# EAGLE design mcu_energy (EAGLE 9.5.2)
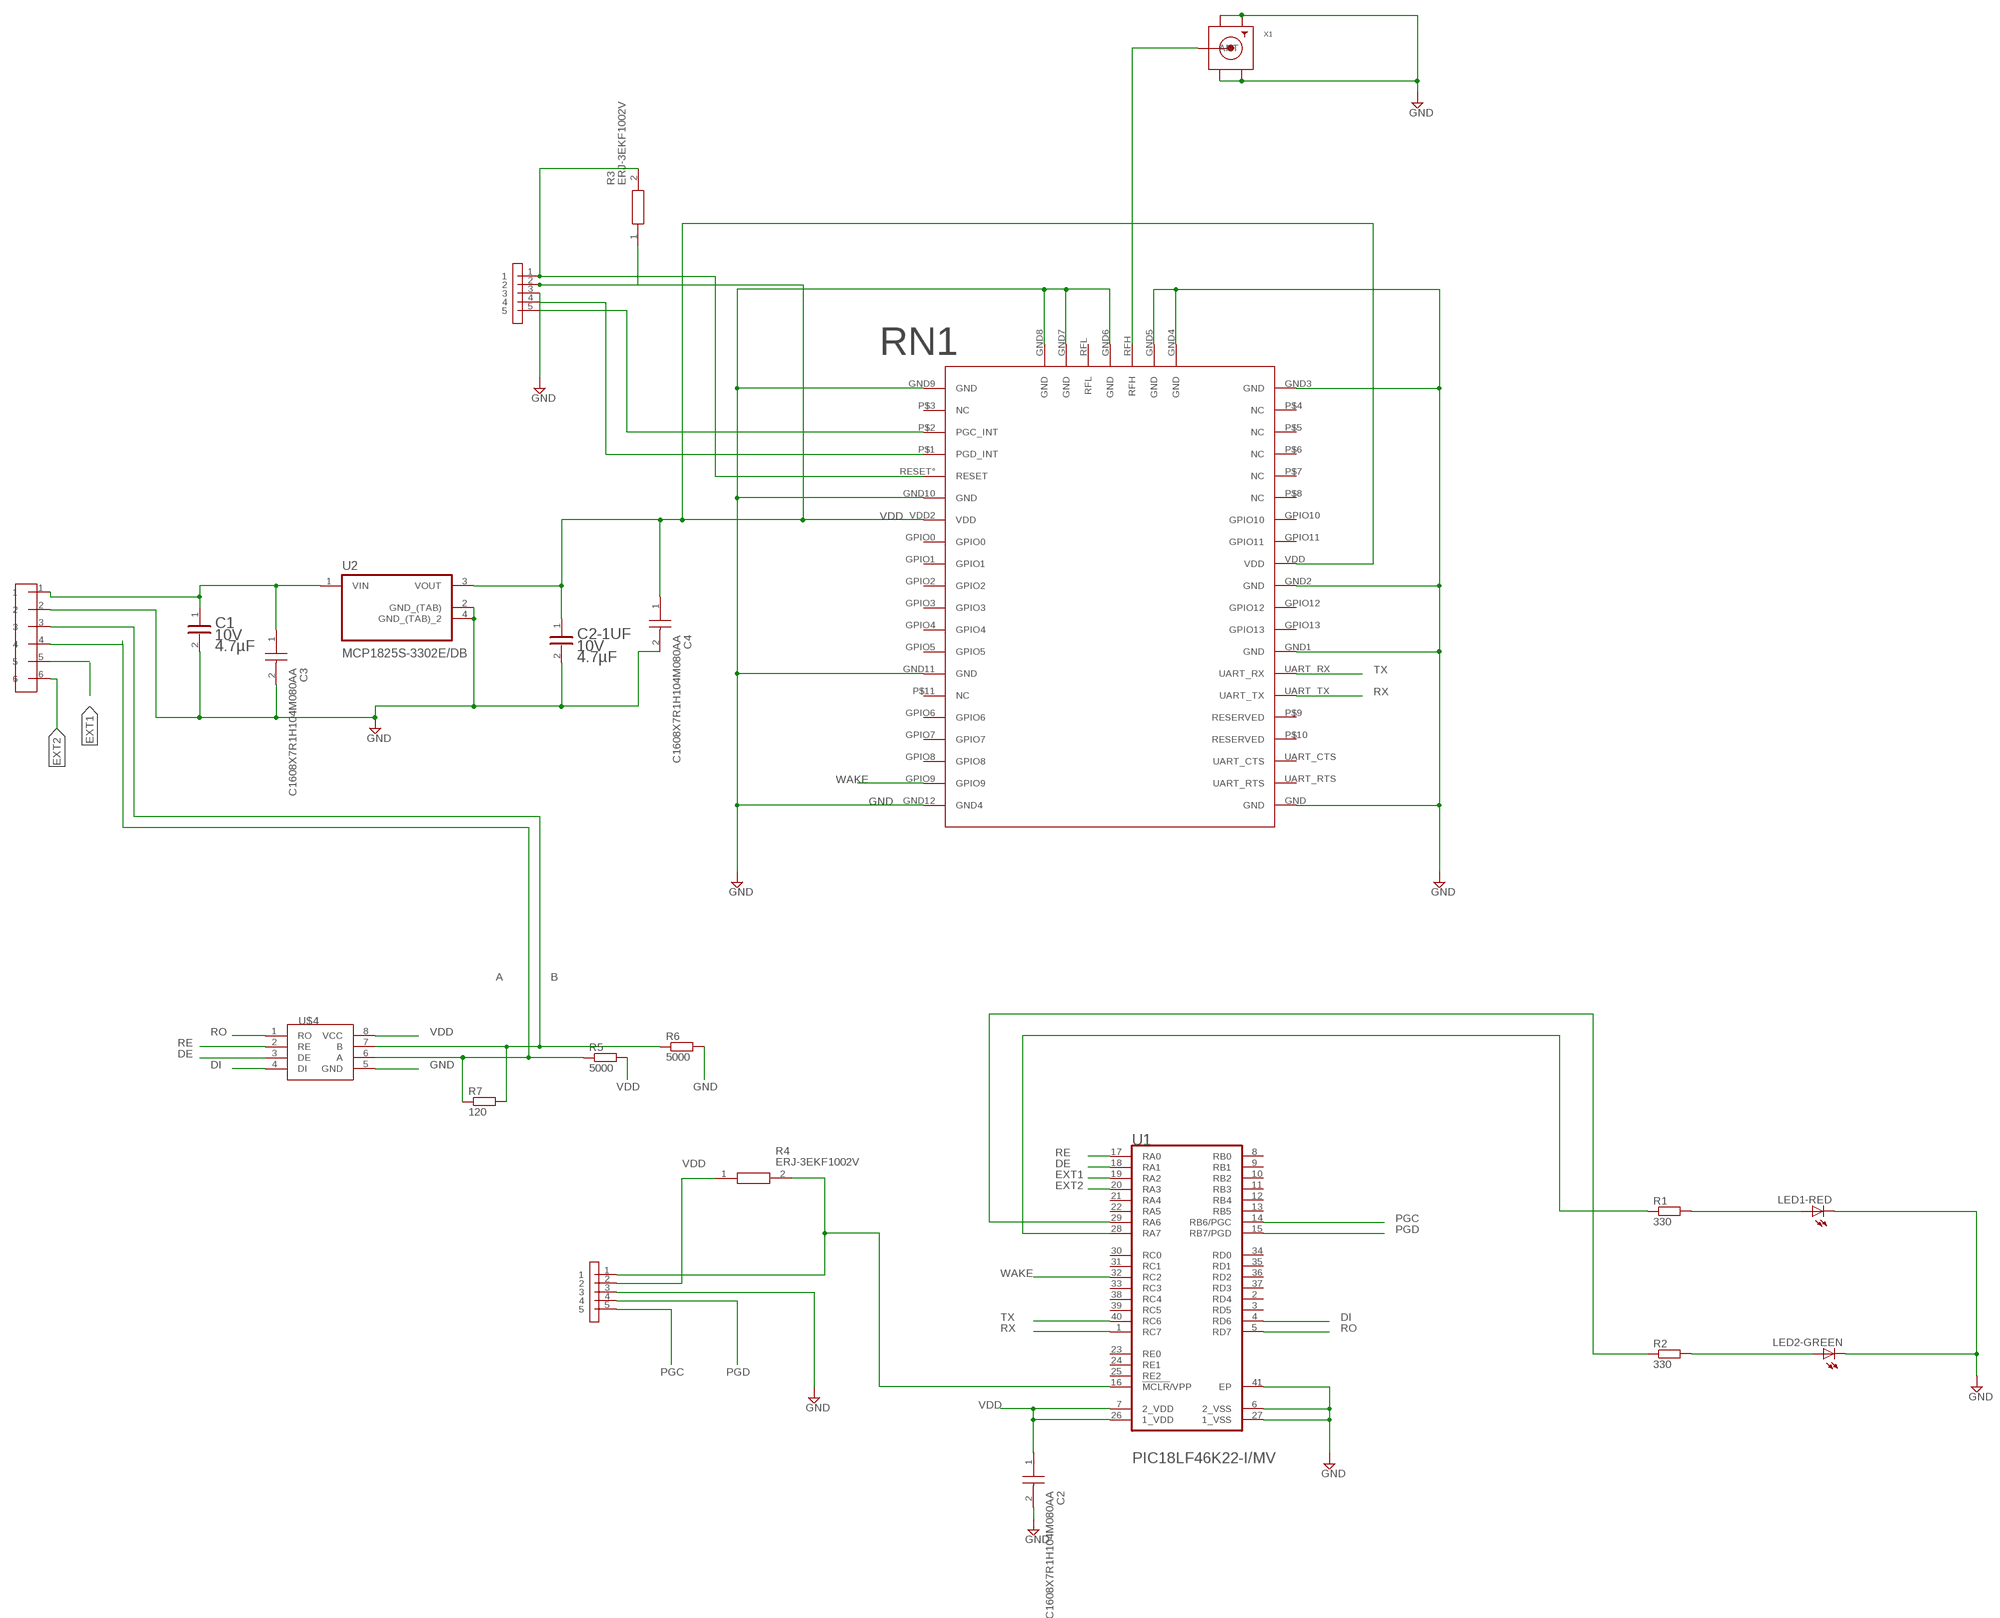
[diagram p0: schematic, sheet 1]

## Parts
C1  KEMET_C0603C475K8PACTUKEMET_C0603C475K8PACTU_0_0  [KEMET_C0603C475K8PACTU_0]
C2  C1608X7R1H104M080AA  [CAPC1608X80N]
C2-1UF  KEMET_C0603C475K8PACTUKEMET_C0603C475K8PACTU_0_0  [KEMET_C0603C475K8PACTU_0]
C3  C1608X7R1H104M080AA  [CAPC1608X80N]
C4  C1608X7R1H104M080AA  [CAPC1608X80N]
LED1-RED  LEDCHIP-LED0603  [CHIP-LED0603]
LED2-GREEN  LEDCHIP-LED0603  [CHIP-LED0603]
R1  330  R-EU_R0603  [R0603]
R2  330  R-EU_R0603  [R0603]
R3  ERJ-3EKF1002V  [RESC1608X55N]
R4  ERJ-3EKF1002V  [RESC1608X55N]
R5  5000  R-EU_R0805  [R0805]
R6  5000  R-EU_R0805  [R0805]
R7  120  R-EU_R0805  [R0805]
RN1  NEW_RN2483  [NEW_RN2483]
U1  MICROCHIP_PIC18LF46K22-I-MVMICROCHIP_PIC18LF46K22-I-MV_0_1  [MICROCHIP_PIC18LF46K22-I-MV_1]
U2  MCP1825S-3302E/DB  [SOT230P700X180-4N]
U$1  CONNECTOR62  [CONNECTOR6]
U$2  ICSP52  [ICSP]
U$3  ICSP52  [ICSP]
U$4  AMD3485E  [AMD3485E]
X1  SMACONNECTOR_EDGE  [SMA_EDGELAUNCH]

## Nets
A: R5.1 R7.1 U$1.4 U$4.6(A)
B: R6.1 R7.2 U$1.3 U$4.7(B)
DE: U1.18(RA1) U$4.3(DE)
DI: U1.4(RD6) U$4.4(DI)
EXT1: U1.19(RA2) U$1.5
EXT2: U1.20(RA3) U$1.6
GND: C1.2 C2-1UF.2 C2.2 C3.2 C4.2 LED1-RED.C LED2-GREEN.C R6.2 RN1.GND RN1.GND1(GND) RN1.GND2(GND) RN1.GND3(GND) RN1.GND4(GND) RN1.GND5(GND) RN1.GND6(GND) RN1.GND7(GND) RN1.GND8(GND) RN1.GND9(GND) RN1.GND10(GND) RN1.GND11(GND) RN1.GND12(GND4) U1.6(2_VSS) U1.27(1_VSS) U1.41(EP) U2.2(GND_(TAB)) U2.4(GND_(TAB)_2) U$1.2 U$2.3 U$3.3 U$4.5(GND) X1.GND@1(GND4) X1.GND@2(GND3) X1.GND@3(GND2) X1.GND@4(GND1)
N$1: LED1-RED.A R1.2
N$2: LED2-GREEN.A R2.2
N$3: R2.1 U1.29(RA6)
N$4: R1.1 U1.28(RA7)
N$5: C1.1 C3.1 U2.1(VIN) U$1.1
N$6: RN1.P$2(PGC_INT) U$3.5
N$7: R4.2 U1.16(!MCLR!/VPP) U$2.1
N$8: RN1.P$1(PGD_INT) U$3.4
N$9: R3.2 RN1.RESET°(RESET) U$3.1
N$10: RN1.RFH X1.P(ANT)
PGC: U1.14(RB6/PGC) U$2.5
PGD: U1.15(RB7/PGD) U$2.4
RE: U1.17(RA0) U$4.2(RE)
RO: U1.5(RD7) U$4.1(RO)
RX: RN1.UART_TX U1.1(RC7)
TX: RN1.UART_RX U1.40(RC6)
VDD: C2-1UF.1 C2.1 C4.1 R3.1 R4.1 R5.2 RN1.VDD RN1.VDD2(VDD) U1.7(2_VDD) U1.26(1_VDD) U2.3(VOUT) U$2.2 U$3.2 U$4.8(VCC)
WAKE: RN1.GPIO9 U1.32(RC2)
Unconnected: RN1.GPIO0 RN1.GPIO1 RN1.GPIO2 RN1.GPIO3 RN1.GPIO4 RN1.GPIO5 RN1.GPIO6 RN1.GPIO7 RN1.GPIO8 RN1.GPIO10 RN1.GPIO11 RN1.GPIO12 RN1.GPIO13 RN1.P$3(NC) RN1.P$4(NC) RN1.P$5(NC) RN1.P$6(NC) RN1.P$7(NC) RN1.P$8(NC) RN1.P$9(RESERVED) RN1.P$10(RESERVED) RN1.P$11(NC) RN1.RFL RN1.UART_CTS RN1.UART_RTS U1.2(RD4) U1.3(RD5) U1.8(RB0) U1.9(RB1) U1.10(RB2) U1.11(RB3) U1.12(RB4) U1.13(RB5) U1.21(RA4) U1.22(RA5) U1.23(RE0) U1.24(RE1) U1.25(RE2) U1.30(RC0) U1.31(RC1) U1.33(RC3) U1.34(RD0) U1.35(RD1) U1.36(RD2) U1.37(RD3) U1.38(RC4) U1.39(RC5)

## Library data of the parts
C1 C2-1UF = Kemet - C0603C475K8PACTU:KEMET_C0603C475K8PACTU: CAP CER 4.7UF 10V X5R 0603; CAPACITANCE: 4.7µF; CENTROID_NOT_SPECIFIED: No; DATASHEET: https://search.kemet.com/component-edge/download/datasheet/C0603C475K8PACTU.pdf; DIGIKEY_DESCRIPTION: CAP CER 4.7UF 10V X5R 0603; DIGIKEY_PART_NUMBER: 399-5503-1-ND; LEAD_FREE: yes; MF: Kemet; MFG_PACKAGE_IDENT: C0603; MOUSER_DESCRIPTION: Multilayer Ceramic Capacitors MLCC - SMD/SMT 10volts 4.7uF 10% X5R; MOUSER_PART_NUMBER: 80-C0603C475K8P; MPN: C0603C475K8PACTU; PACKAGE: 0603; PREFIX: C; ROHS: yes; TEMPERATURE_RANGE_HIGH: +85°C; TEMPERATURE_RANGE_LOW: -55°C; VOLTAGE: 10V
C2-C4 = C1608X7R1H104M080AA:C1608X7R1H104M080AA: TDK 0603 C 100nF Ceramic Multilayer Capacitor, 50 V dc, +125C, X7R Dielectric, +/-20% Source: Datasheet <https://product.tdk.com/info/en/catalog/datasheets/mlcc_commercial_midvoltage_en.pdf>; ARROW_PART_NUMBER: C1608X7R1H104M080AA; ARROW_PRICE-STOCK: https://www.arrow.com/en/products/c1608x7r1h104m080aa/tdk; DESCRIPTION: TDK 0603 C 100nF Ceramic Multilayer Capacitor, 50 V dc, +125C, X7R Dielectric, +/-20%; HEIGHT: 0.8mm; MANUFACTURER_NAME: TDK; MANUFACTURER_PART_NUMBER: C1608X7R1H104M080AA; MOUSER_PART_NUMBER: 810-C1608X7R1H104M; MOUSER_PRICE-STOCK: https://www.mouser.co.uk/ProductDetail/TDK/C1608X7R1H104M080AA?qs=dfay7wIA1uEL2BE%2FFUaTdg%3D%3D
LED1-RED LED2-GREEN = adafruit:LED: LED OSRAM: - CHIPLED LG R971, LG N971, LY N971, LG Q971, LY Q971, LO R971, LY R971 LH N974, LH R974 LS Q976, LO Q976, LY Q976 LO Q996 - Hyper CHIPLED LW Q18S LB Q993, LB Q99A, LB R99A - SideLED LS A670, LO A670, LY A670, LG A670, LP A670 LB A673, LV A673, LT A673, LW A673 LH A674 LY A675 LS A676, LA A676, LO A676, LY A676, LW A676 LS A679, LY A679, LG A679 - Hyper Micro SIDELED® LS Y876, LA Y876, LO Y876, LY Y876 LT Y87S - SmartLED LW L88C, LW L88S LB L89C, LB L89S, LG L890 LS L89K, LO L89K, LY L89K LS L896, LA L896, LO L896, LY L896 - TOPLED LS T670, LO T670, LY T670, LG T670, LP T670 LSG T670, LSP T670, LSY T670, LOP T670, LYG T670 LG T671, LOG T671, LSG T671 LB T673, LV T673, LT T673, LW T673 LH T674 LS T676, LA T676, LO T676, LY T676, LB T676, LH T676, LSB T676, LW T676 LB T67C, LV T67C, LT T67C, LS T67K, LO T67K, LY T67K, LW E67C LS E67B, LA E67B, LO E67B, LY E67B, LB E67C, LV E67C, LT E67C LW T67C LS T679, LY T679, LG T679 LS T770, LO T770, LY T770, LG T770, LP T770 LB T773, LV T773, LT T773, LW T773 LH T774 LS E675, LA E675, LY E675, LS T675 LS T776, LA T776, LO T776, LY T776, LB T776 LHGB T686 LT T68C, LB T68C - Hyper Mini TOPLED® LB M676 - Mini TOPLED Santana® LG M470 LS M47K, LO M47K, LY M47K Source: http://www.osram.convergy.de/
R1 R2 = rcl:R-EU_: RESISTOR, European symbol
R3 R4 = ERJ-3EKF1002V:ERJ-3EKF1002V: Thick Film Resistors - SMD 0603 10Kohms 1% AEC-Q200 Source: Datasheet <http://industrial.panasonic.com/cdbs/www-data/pdf/RDA0000/AOA0000C86.pdf>; ARROW_PART_NUMBER: ERJ-3EKF1002V; ARROW_PRICE-STOCK: https://www.arrow.com/en/products/erj-3ekf1002v/panasonic; DESCRIPTION: Thick Film Resistors - SMD 0603 10Kohms 1% AEC-Q200; HEIGHT: 0.55mm; MANUFACTURER_NAME: Panasonic; MANUFACTURER_PART_NUMBER: ERJ-3EKF1002V; MOUSER_PART_NUMBER: 667-ERJ-3EKF1002V; MOUSER_PRICE-STOCK: https://www.mouser.co.uk/ProductDetail/Panasonic/ERJ-3EKF1002V?qs=H7k1u0Mp9JSrGPQ5%2F5COuw%3D%3D
R5-R7 = rcl:R-EU_: RESISTOR, European symbol; SPICEPREFIX: R
RN1 = tobias:NEW_RN2483
U1 = MV:MICROCHIP_PIC18LF46K22-I-MV: MCHP-PIC18F4XK22-UQFN-40; CIIVA_IDS: 1156885; COMPONENT_LINK_2_DESCRIPTION: Package Specification; COMPONENT_LINK_2_URL: http://www.microchip.com/stellent/groups/techpub_sg/documents/packagingspec/en012702.pdf; COMPONENT_LINK_3_DESCRIPTION: URL Link1; COMPONENT_LINK_3_URL: Product URL:http://www.microchip.com/datasheet/PIC18F46K22; DATASHEET: http://ww1.microchip.com/downloads/en/DeviceDoc/41412F.pdf; DATASHEET_VERSION: Rev. F; DIGITAL_COMMUNICATION: 2-A/E/USART, 2-MSSP(SPI/I2C); EEPROM_DATA_MEMORY_BYTES: 1024; FOOTPRINT_VARIANT_NAME_0: Level C; FOOTPRINT_VARIANT_NAME_1: Level B; FOOTPRINT_VARIANT_NAME_2: Level A; IMPORTED: yes; IMPORTED_FROM: vault; IMPORT_TS: 1521862508; INTERNAL_OSCILLATOR: 16 MHz, 31 kHz; IO_PINS: 35; MAX_CPU_SPEED_MHZ: 16; MEMORY_TYPE: Flash; MF: Microchip; MOUNTING_TECHNOLOGY: Surface Mount; MPN: PIC18LF46K22-I/MV; OF_AD_CHANNELS: 28; OPERATION_VOLTAGE_RANGE: 1.8V - 3.6V; PACKAGE: UQFN-MV40; PACKAGE_DESCRIPTION: 40-Lead Plastic Ultra Thin Quad Flat, No Lead Package, Body 5 x 5 mm, Pitch 0.4 mm; PACKAGE_VERSION: C04-156A, 04/2013; PACKING: TUBE; PIN_0_0_13_INSIDE_EDGE: clock; PREFIX: U; PROGRAM_MEMORY_KBYTES: 64; PROGRAM_MEMORY_KWORDS: 32; RAM: 3896; RELEASE_DATE: 1370054166; TIMERS: 3 - 8-bit, 4 - 16-bit; VAULT_GUID: 4AD4499F-4258-456F-8BC1-D82EC74C6FCE; VAULT_REVISION: 1F45D5E2-C531-4F36-B47A-F05F4A728A22
U2 = MCP1825S-3302E_DB:MCP1825S-3302E/DB; AVAILABILITY: Unavailable; DESCRIPTION: Linear Voltage Regulator IC 1 Output 500mA SOT-223-3; MF: Microchip; MP: MCP1825S-3302E/DB; PACKAGE: SOT-223 Microchip; PRICE: None
U$1 = conn4:CONNECTOR62
U$2 U$3 = conn4:ICSP52
U$4 = AMD3485E:AMD3485E
X1 = adafruit:SMACONNECTOR: SMA Connector 90° DIP SMA Connector, 50 Ohm (4UConnector: 07259)

## Board
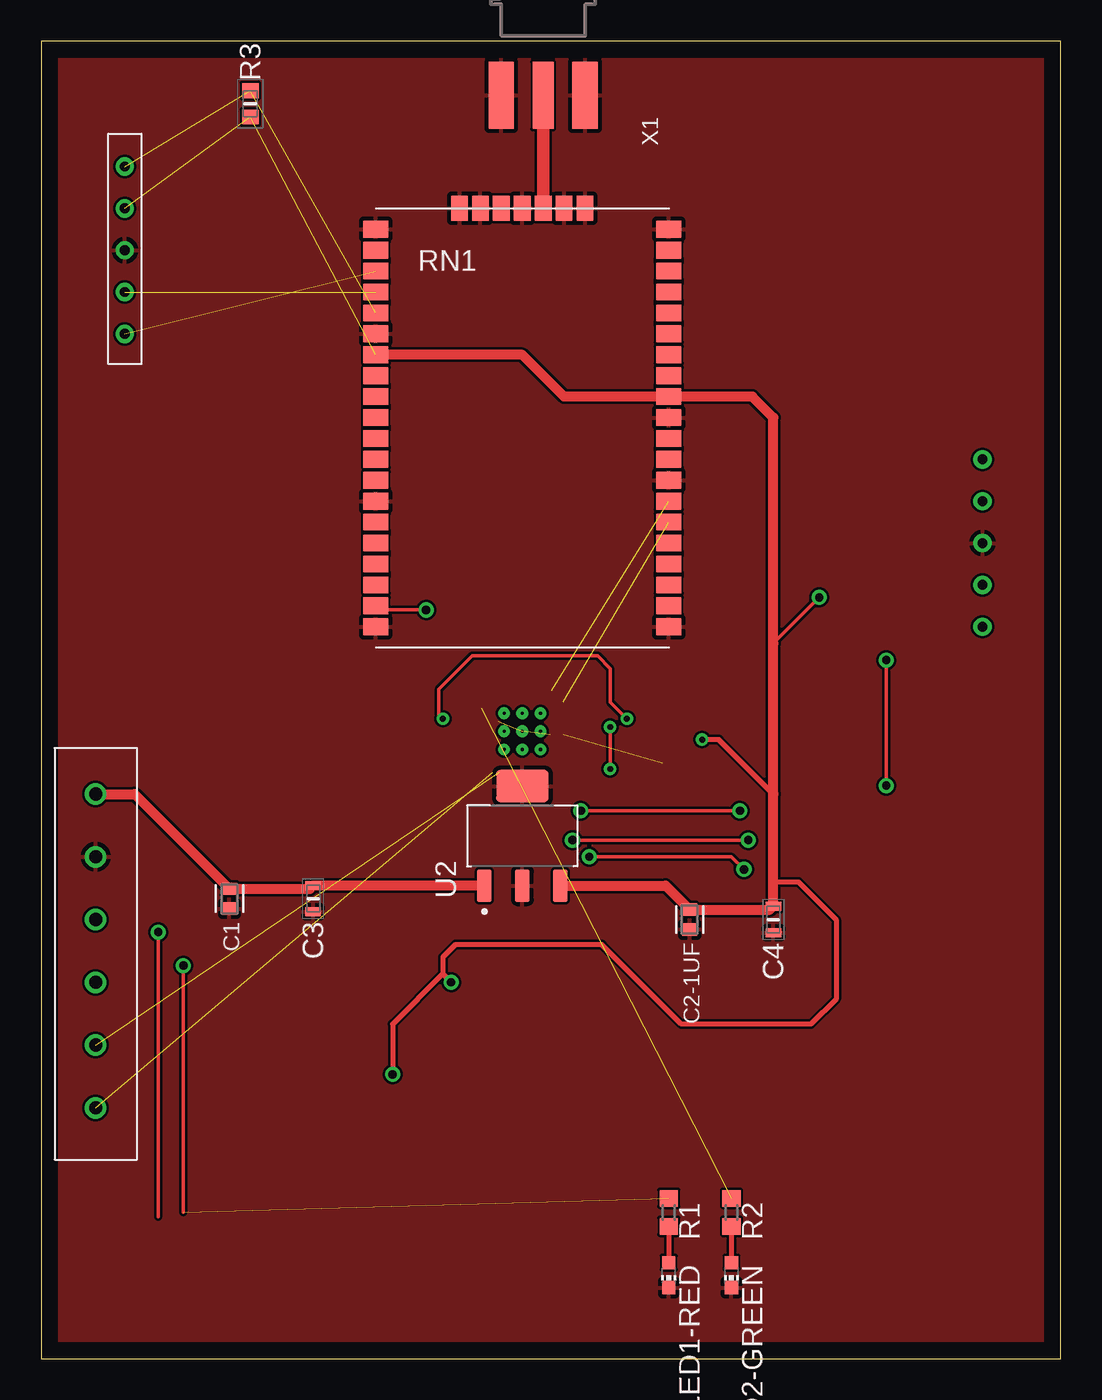
[diagram p1: board, top side]
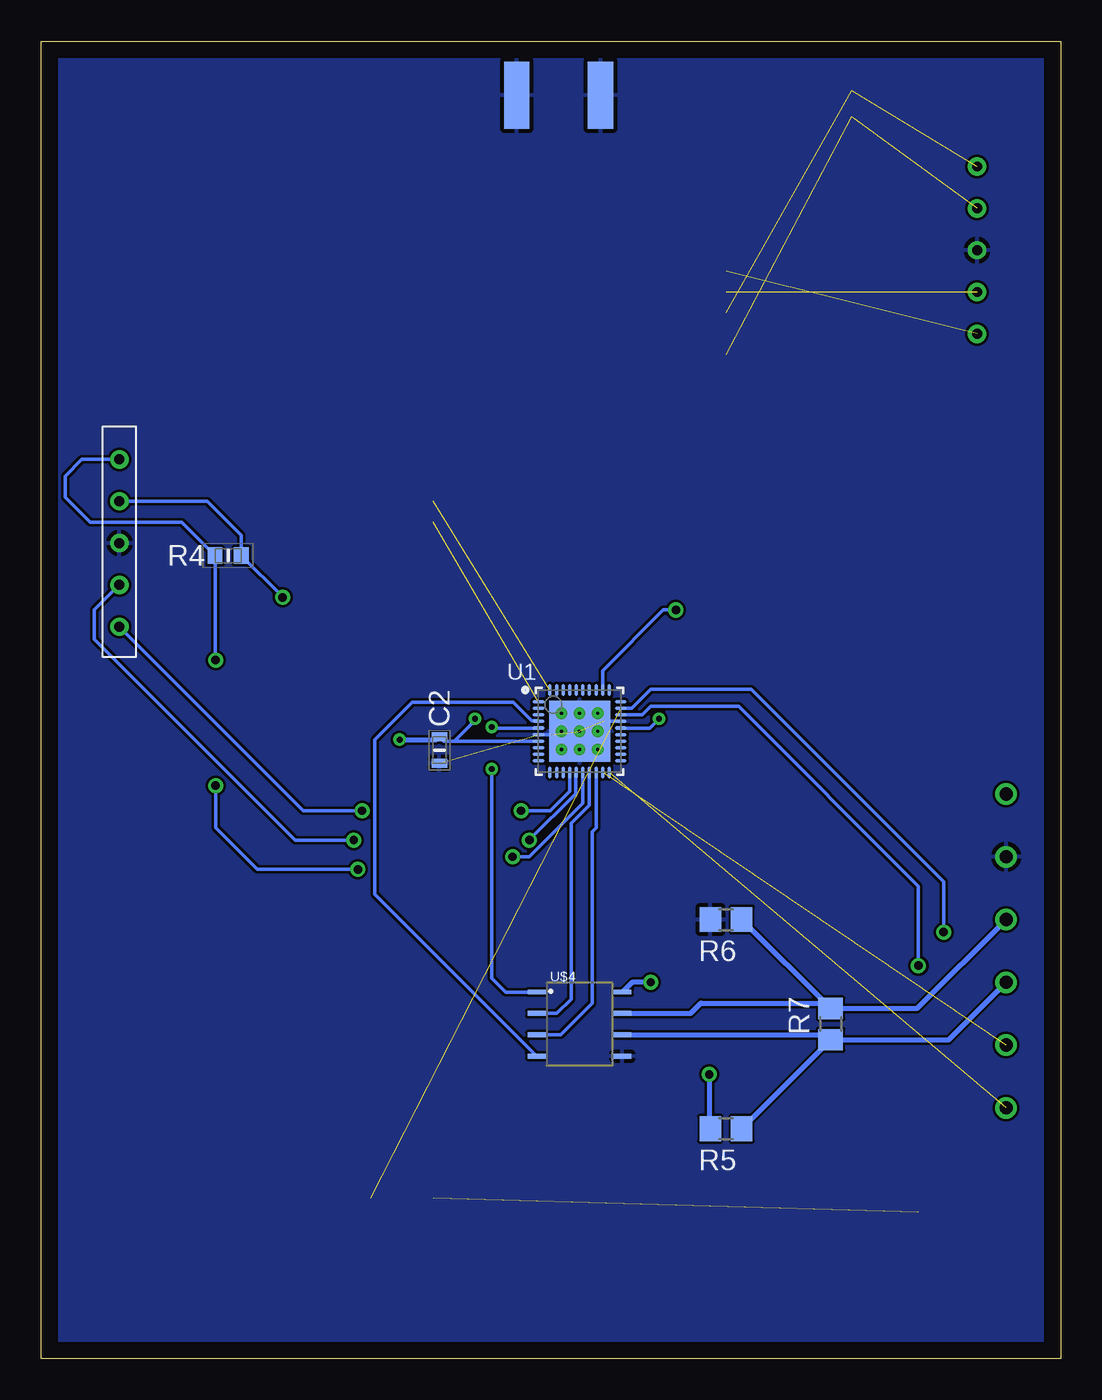
[diagram p2: board, bottom side, seen from below]

Size 61.9 x 80 mm. Coordinates in mm from the lower left corner, seen from the top.
Outline: 0,0 61.9,0 61.9,80 0,80 0,0
Copper layers (1*16): Top 0.035mm / dielectric 1.5mm / Bottom 0.035mm
Design rules "default": minimum track width 6mil, minimum drill 0.35mm, track to track 6mil, track to pad 6mil, pad to pad 6mil, via to via 6mil, smd to smd 6mil, copper to edge 40mil, drill to drill 6mil, minimum pad ring 10mil, minimum via ring 8mil, stop-mask expansion 4mil, vias tented up to drill 0mil, thermal gap 10mil

### Footprints (pad centres in the part's own frame; a part is rotated, then mirrored left to right if it is on the bottom)
KEMET_C0603C475K8PACTU_0 = smd 0.75 x 0.9: 1 -0.6,0; 2 0.6,0
CAPC1608X80N = smd 0.54 x 0.94: 1 -0.8,0; 2 0.8,0
CHIP-LED0603 = smd 0.8 x 0.8: A 0,-0.75; C 0,0.75
R0603 = smd 1 x 1.1: 1 -0.85,0; 2 0.85,0
RESC1608X55N = smd 0.9 x 1: 1 -0.8,0; 2 0.8,0
R0805 = smd 1.3 x 1.5: 1 -0.95,0; 2 0.95,0
NEW_RN2483 = smd 1.524 x 1.016: GND 17.78,1.27; GND1 17.78,10.16; GND2 17.78,13.97; GND3 17.78,25.4; GND9 0,25.4; GND10 0,19.05; GND11 0,8.89; GND12 0,1.27; GPIO0 0,16.51; GPIO1 0,15.24; GPIO2 0,13.97; GPIO3 0,12.7; GPIO4 0,11.43; GPIO5 0,10.16; GPIO6 0,6.35; GPIO7 0,5.08; GPIO8 0,3.81; GPIO9 0,2.54; GPIO10 17.78,17.78; GPIO11 17.78,16.51; GPIO12 17.78,12.7; GPIO13 17.78,11.43; P$1 0,21.59; P$2 0,22.86; P$3 0,24.13; P$4 17.78,24.13; P$5 17.78,22.86; P$6 17.78,21.59; P$7 17.78,20.32; P$8 17.78,19.05; P$9 17.78,6.35; P$10 17.78,5.08; P$11 0,7.62; RESET° 0,20.32; UART_CTS 17.78,3.81; UART_RTS 17.78,2.54; UART_RX 17.78,8.89; UART_TX 17.78,7.62; VDD 17.78,15.24; VDD2 0,17.78 | smd 1.016 x 1.524: GND4 12.7,26.67; GND5 11.43,26.67; GND6 8.89,26.67; GND7 6.35,26.67; GND8 5.08,26.67; RFH 10.16,26.67; RFL 7.62,26.67
MICROCHIP_PIC18LF46K22-I-MV_1 = smd 0.7 x 0.2: 1 -2.5,1.8; 2 -2.5,1.4; 3 -2.5,1; 4 -2.5,0.6; 5 -2.5,0.2; 6 -2.5,-0.2; 7 -2.5,-0.6; 8 -2.5,-1; 9 -2.5,-1.4; 10 -2.5,-1.8; 21 2.5,-1.8; 22 2.5,-1.4; 23 2.5,-1; 24 2.5,-0.6; 25 2.5,-0.2; 26 2.5,0.2; 27 2.5,0.6; 28 2.5,1; 29 2.5,1.4; 30 2.5,1.8 | smd 0.2 x 0.7: 11 -1.8,-2.5; 12 -1.4,-2.5; 13 -1,-2.5; 14 -0.6,-2.5; 15 -0.2,-2.5; 16 0.2,-2.5; 17 0.6,-2.5; 18 1,-2.5; 19 1.4,-2.5; 20 1.8,-2.5; 31 1.8,2.5; 32 1.4,2.5; 33 1,2.5; 34 0.6,2.5; 35 0.2,2.5; 36 -0.2,2.5; 37 -0.6,2.5; 38 -1,2.5; 39 -1.4,2.5; 40 -1.8,2.5 | smd 3.7 x 3.7: 41 0,0 | drill 0.2 pad 0.5: PAD_1 1.1,-1.1; PAD_2 0,-1.1; PAD_3 -1.1,-1.1; PAD_4 1.1,0; PAD_5 0,0; PAD_6 -1.1,0; PAD_7 1.1,1.1; PAD_8 0,1.1; PAD_9 -1.1,1.1
SOT230P700X180-4N = smd 1.97 x 0.89: 1 -3.025,2.3; 2 -3.025,0; 3 -3.025,-2.3 | smd 1.97 x 3.19: 4 3.025,0
CONNECTOR6 = drill 0.8: 1 -0.5,-3.81; 2 -0.5,-7.62; 3 -0.5,-11.43; 4 -0.5,-15.24; 5 -0.5,-19.05; 6 -0.5,-22.86
ICSP = drill 0.6: 1 -0.002,-0.002; 2 -0.002,-2.542; 3 -0.002,-5.082; 4 -0.002,-7.622; 5 -0.002,-10.162
AMD3485E = smd 1.1 x 0.3: 1 -2.6,1.95; 2 -2.6,0.65; 3 -2.6,-0.65; 4 -2.6,-1.95; 5 2.6,-1.95; 6 2.6,-0.65; 7 2.6,0.65; 8 2.6,1.95
SMA_EDGELAUNCH = smd 4.064 x 1.524: GND@1 2.032,-2.54; GND@2 2.032,2.54 | smd 4.064 x 1.524 bottom: GND@3 2.032,2.54; GND@4 2.032,-2.54 | smd 4.064 x 1.27: P 2.032,0

### Placement (x,y rotation side)
C1  11.43,27.94 270 top
C2  37.72,36.96 270 bottom
C2-1UF  39.37,26.67 270 top
C3  16.51,27.94 270 top
C4  44.45,26.67 270 top
LED1-RED  38.1,5.08 180 top
LED2-GREEN  41.91,5.08 180 top
R1  38.1,8.89 270 top
R2  41.91,8.89 270 top
R3  12.7,76.2 90 top
R4  50.55,48.77 180 bottom
R5  20.32,13.97 180 bottom
R6  20.32,26.67 180 bottom
R7  13.97,20.32 90 bottom
RN1  20.32,43.18 0 top
U1  29.21,38.1 0 bottom
U2  29.21,31.75 90 top
U$1  3.81,38.1 0 top
U$2  57.15,54.61 0 bottom
U$3  5.08,72.39 0 top
U$4  29.21,20.32 0 bottom
X1  30.48,78.74 270 top

### Tracks (layer width: path | path; a pad name or v marks a point on that pad's centre or on a via)
A
  Bottom 0.305: U$4.6 14.27,19.67 R7.1 | R5.1 R7.1 | R7.1 6.8,19.37 U$1.4
B
  Bottom 0.305: U$4.7 22.46,20.97 21.84,21.59 14.29,21.59 R7.2 | R6.1 R7.2 | R7.2 8.71,21.27 U$1.3
DE
  Bottom 0.203: U$4.3 30.37,19.67 28.45,21.59 28.45,32 28.19,32.26 28.19,35.58 U1.18
DI
  Bottom 0.203: U$4.4 41.66,28.22 41.66,37.59 39.37,39.88 33.24,39.88 32.11,38.75 31.76,38.75 U1.4
EXT1  (1 unrouted)
EXT2  (1 unrouted)
GND  (3 unrouted)
  Bottom 0.203: U1.6 30.92,37.9 | U1.27 27.75,38.7
  pour Bottom: -1.27,87.63 99.06,87.63 104.14,82.55 104.14,-15.24 101.6,-17.78 -1.27,-17.78 -8.89,-10.16 -8.89,80.01
  pour Top: -7.62,92.71 106.68,92.71 111.76,87.63 111.76,-21.59 109.22,-24.13 -7.62,-24.13 -16.51,-15.24 -16.51,81.28 -16.51,83.82
N$1
  Top 0.305: R1.2 LED1-RED.A
N$2
  Top 0.305: R2.2 LED2-GREEN.A
N$3  (via drill 0.51)  (1 unrouted)
  Top 0.203: v7.11,25.91 7.11,8.64
  Bottom 0.203: U1.29 26.03,39.5 24.89,40.64 18.8,40.64 7.11,28.96 v7.11,25.91
N$4  (via drill 0.51)  (1 unrouted)
  Top 0.203: v8.64,23.88 8.64,8.89
  Bottom 0.203: U1.28 25.42,39.1 24.89,39.62 19.56,39.62 8.64,28.7 v8.64,23.88
N$5
  Top 0.61: U$1.1 5.68,34.29 C1.1 16.31,28.54 C3.1 26.89,28.74 U2.1
N$6  (1 unrouted)
N$7  (via drill 0.51)
  Top 0.203: v33.27,30.48 41.91,30.48 v42.67,29.72 | v51.31,42.42 v51.31,34.8
  Bottom 0.203: U1.16 29.01,33.73 32.26,30.48 v33.27,30.48 | v42.67,29.72 48.77,29.72 51.31,32.26 v51.31,34.8 | v51.31,42.42 51.35,42.46 R4.2 53.38,50.8 58.93,50.8 60.45,52.32 60.45,53.59 59.44,54.61 U$2.1
N$8  (1 unrouted)
N$9  (2 unrouted)
N$10
  Top 0.762: X1.P RN1.RFH
PGC  (via drill 0.51)
  Top 0.203: v32.77,33.27 v42.42,33.27
  Bottom 0.203: U1.14 29.81,34.45 30.99,33.27 v32.77,33.27 | v42.42,33.27 45.98,33.27 U$2.5
PGD  (via drill 0.51)
  Top 0.203: v32.26,31.5 v42.93,31.5
  Bottom 0.203: U1.15 29.45,35.56 29.45,34.3 v32.26,31.5 | v42.93,31.5 46.48,31.5 58.67,43.69 58.67,45.47 U$2.4
RE
  Bottom 0.203: U$4.2 30.59,20.97 29.72,21.84 29.72,32.51 28.61,33.62 U1.17
RO  (via drill 0.35)
  Top 0.203: v34.54,35.81 v34.54,38.35
  Bottom 0.203: U$4.1 33.7,22.27 34.54,23.11 v34.54,35.81 | v34.54,38.35 34.49,38.3 U1.5
RX  (1 unrouted)
TX  (1 unrouted)
VDD  (via drill 0.35, 0.51)  (2 unrouted)
  Top 0.203: v35.56,38.86 34.54,39.88 34.54,41.91 33.78,42.67 26.16,42.67 24.13,40.64 24.13,39.12 v24.38,38.86 | v47.24,46.23 44.45,43.43
  Top 0.305: 44.45,34.29 41.15,37.59 v40.13,37.59 | 44.45,28.96 45.97,28.96 48.26,26.67 48.26,21.84 46.74,20.32 38.86,20.32 34.04,25.15 25.15,25.15 24.38,24.38 24.38,23.37 | v24.89,22.86 24.38,23.37 | 24.38,23.37 21.34,20.32 v21.34,17.27
  Top 0.61: U2.3 37.91,28.73 C2-1UF.1 44.25,27.27 C4.1 44.45,28.96 44.45,34.29 44.45,43.43 44.45,57.15 43.18,58.42 RN1.VDD 31.75,58.42 29.21,60.96 RN1.VDD2
  Bottom 0.203: U1.7 36.83,37.5 | 36.83,37.5 37.46,37.5 C2.1 | 36.83,37.5 35.56,38.77 v35.56,38.86 | v24.38,38.86 24.95,38.3 U1.26 | v47.24,46.23 47.24,46.27 R4.1 49.75,50 51.81,52.07 U$2.2
  Bottom 0.305: v40.13,37.59 37.88,37.59 C2.1 | v24.89,22.86 26.02,22.86 U$4.8 | v21.34,17.27 21.34,14.04 R5.2
WAKE  (via drill 0.51)
  Top 0.203: v23.37,45.47 20.57,45.47 RN1.GPIO9
  Bottom 0.203: U1.32 27.81,41.79 24.13,45.47 v23.37,45.47